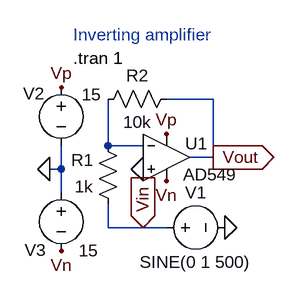
[diagram p0: schematic sch.asc]
sch.asc, the LTspice schematic file:
Version 4
SHEET 1 880 680
WIRE 304 96 240 96
WIRE 160 160 160 96
WIRE 208 160 160 160
WIRE 304 176 304 96
WIRE 304 176 272 176
WIRE 96 192 96 160
WIRE 96 192 80 192
WIRE 96 224 96 192
WIRE 160 272 160 240
WIRE 208 272 160 272
WIRE 240 272 208 272
FLAG 208 192 0
FLAG 304 176 Vout
IOPIN 304 176 Out
FLAG 80 192 0
FLAG 208 272 Vin
IOPIN 208 272 In
FLAG 320 272 0
FLAG 96 80 Vp
FLAG 240 144 Vp
FLAG 96 304 Vn
FLAG 240 208 Vn
SYMBOL OpAmps\\AD549 240 112 R0
WINDOW 0 26 45 Left 2
WINDOW 3 23 88 Left 2
SYMATTR InstName U1
SYMBOL res 176 256 R180
WINDOW 0 36 76 Left 2
WINDOW 3 36 40 Left 2
SYMATTR InstName R1
SYMATTR Value 1k
SYMBOL res 256 80 R90
WINDOW 0 0 56 VBottom 2
WINDOW 3 32 56 VTop 2
SYMATTR InstName R2
SYMATTR Value 10k
SYMBOL voltage 224 272 R270
WINDOW 0 32 56 VTop 2
WINDOW 3 -32 56 VBottom 2
WINDOW 123 0 0 Left 0
WINDOW 39 0 0 Left 0
SYMATTR InstName V1
SYMATTR Value SINE(0 1 500)
SYMBOL voltage 96 64 R0
WINDOW 0 -52 25 Left 2
WINDOW 3 28 26 Left 2
WINDOW 123 0 0 Left 0
WINDOW 39 0 0 Left 0
SYMATTR InstName V2
SYMATTR Value 15
SYMBOL voltage 96 208 R0
WINDOW 0 -50 95 Left 2
WINDOW 123 0 0 Left 0
WINDOW 39 0 0 Left 0
SYMATTR InstName V3
SYMATTR Value 15
TEXT 112 8 Left 2 ;Inverting amplifier
TEXT 112 40 Left 2 !.tran 1

The netlist it stands for:
* sch.asc
XU1 0 N001 Vp Vn Vout AD549  ; pins In+ In- V+ V- OUT
R1 Vin N001 1k
R2 Vout N001 10k
V1 Vin 0 SINE(0 1 500)
V2 Vp 0 15
V3 0 Vn 15
* Inverting amplifier
.tran 1
.backanno
.end